# EAGLE board PFC MINI (EAGLE 9.2.2), part 1 of 2
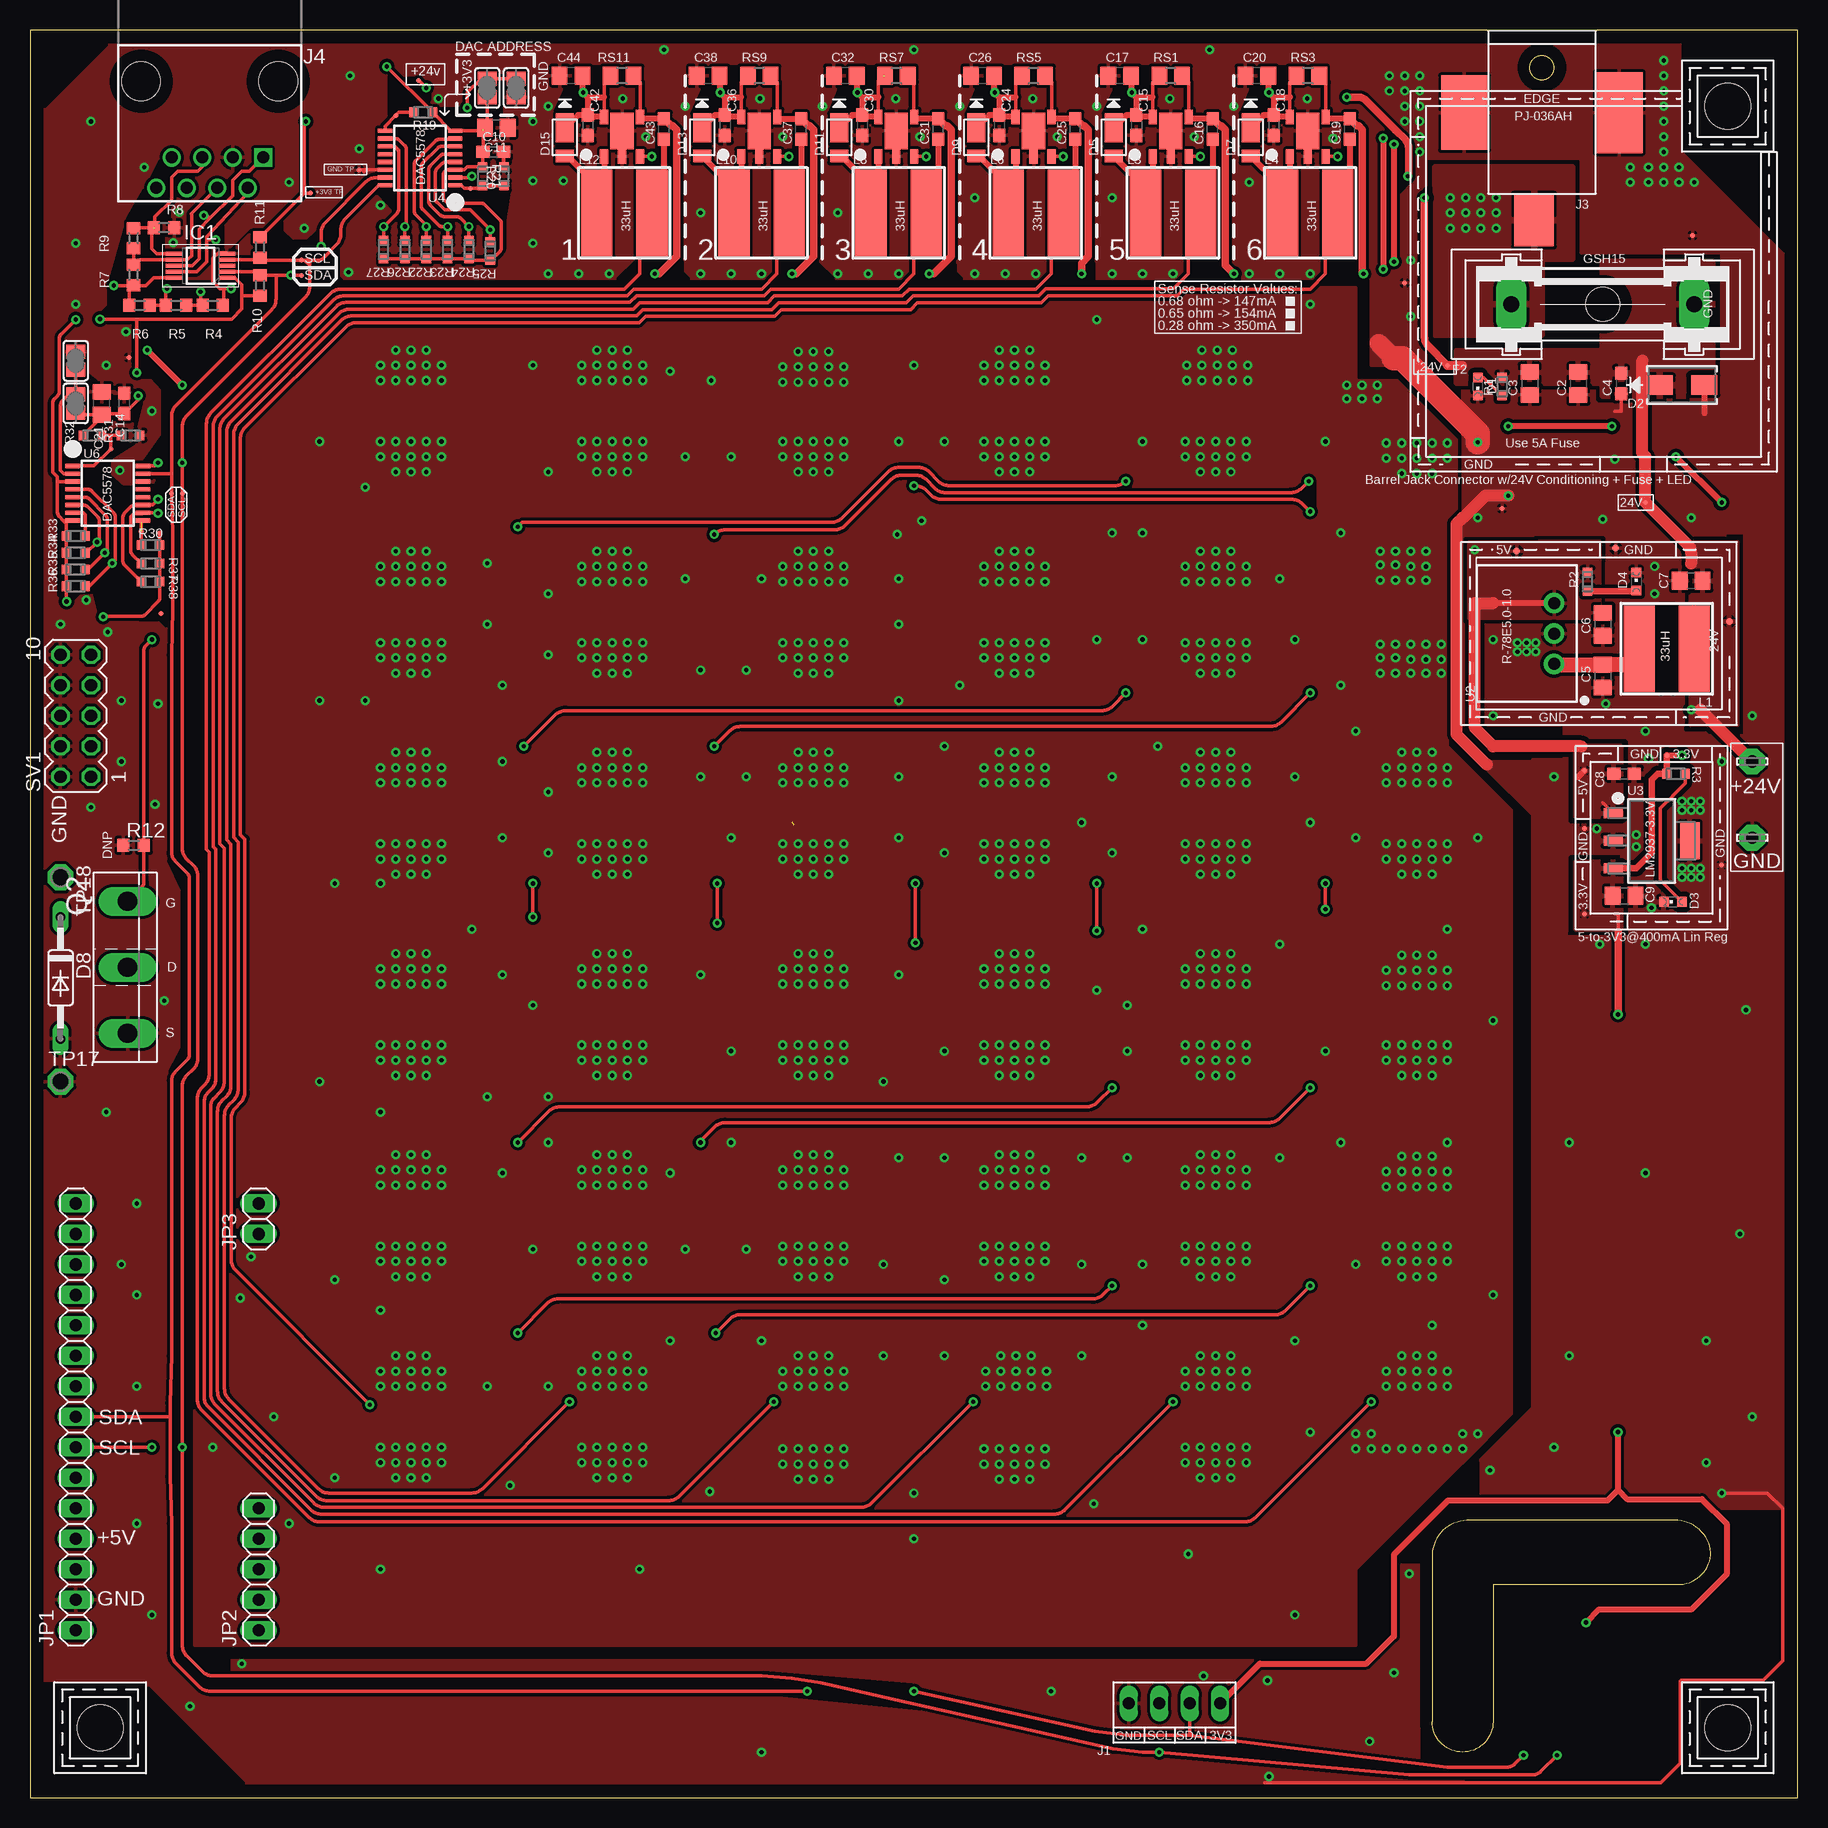
[diagram p3: board, top side]
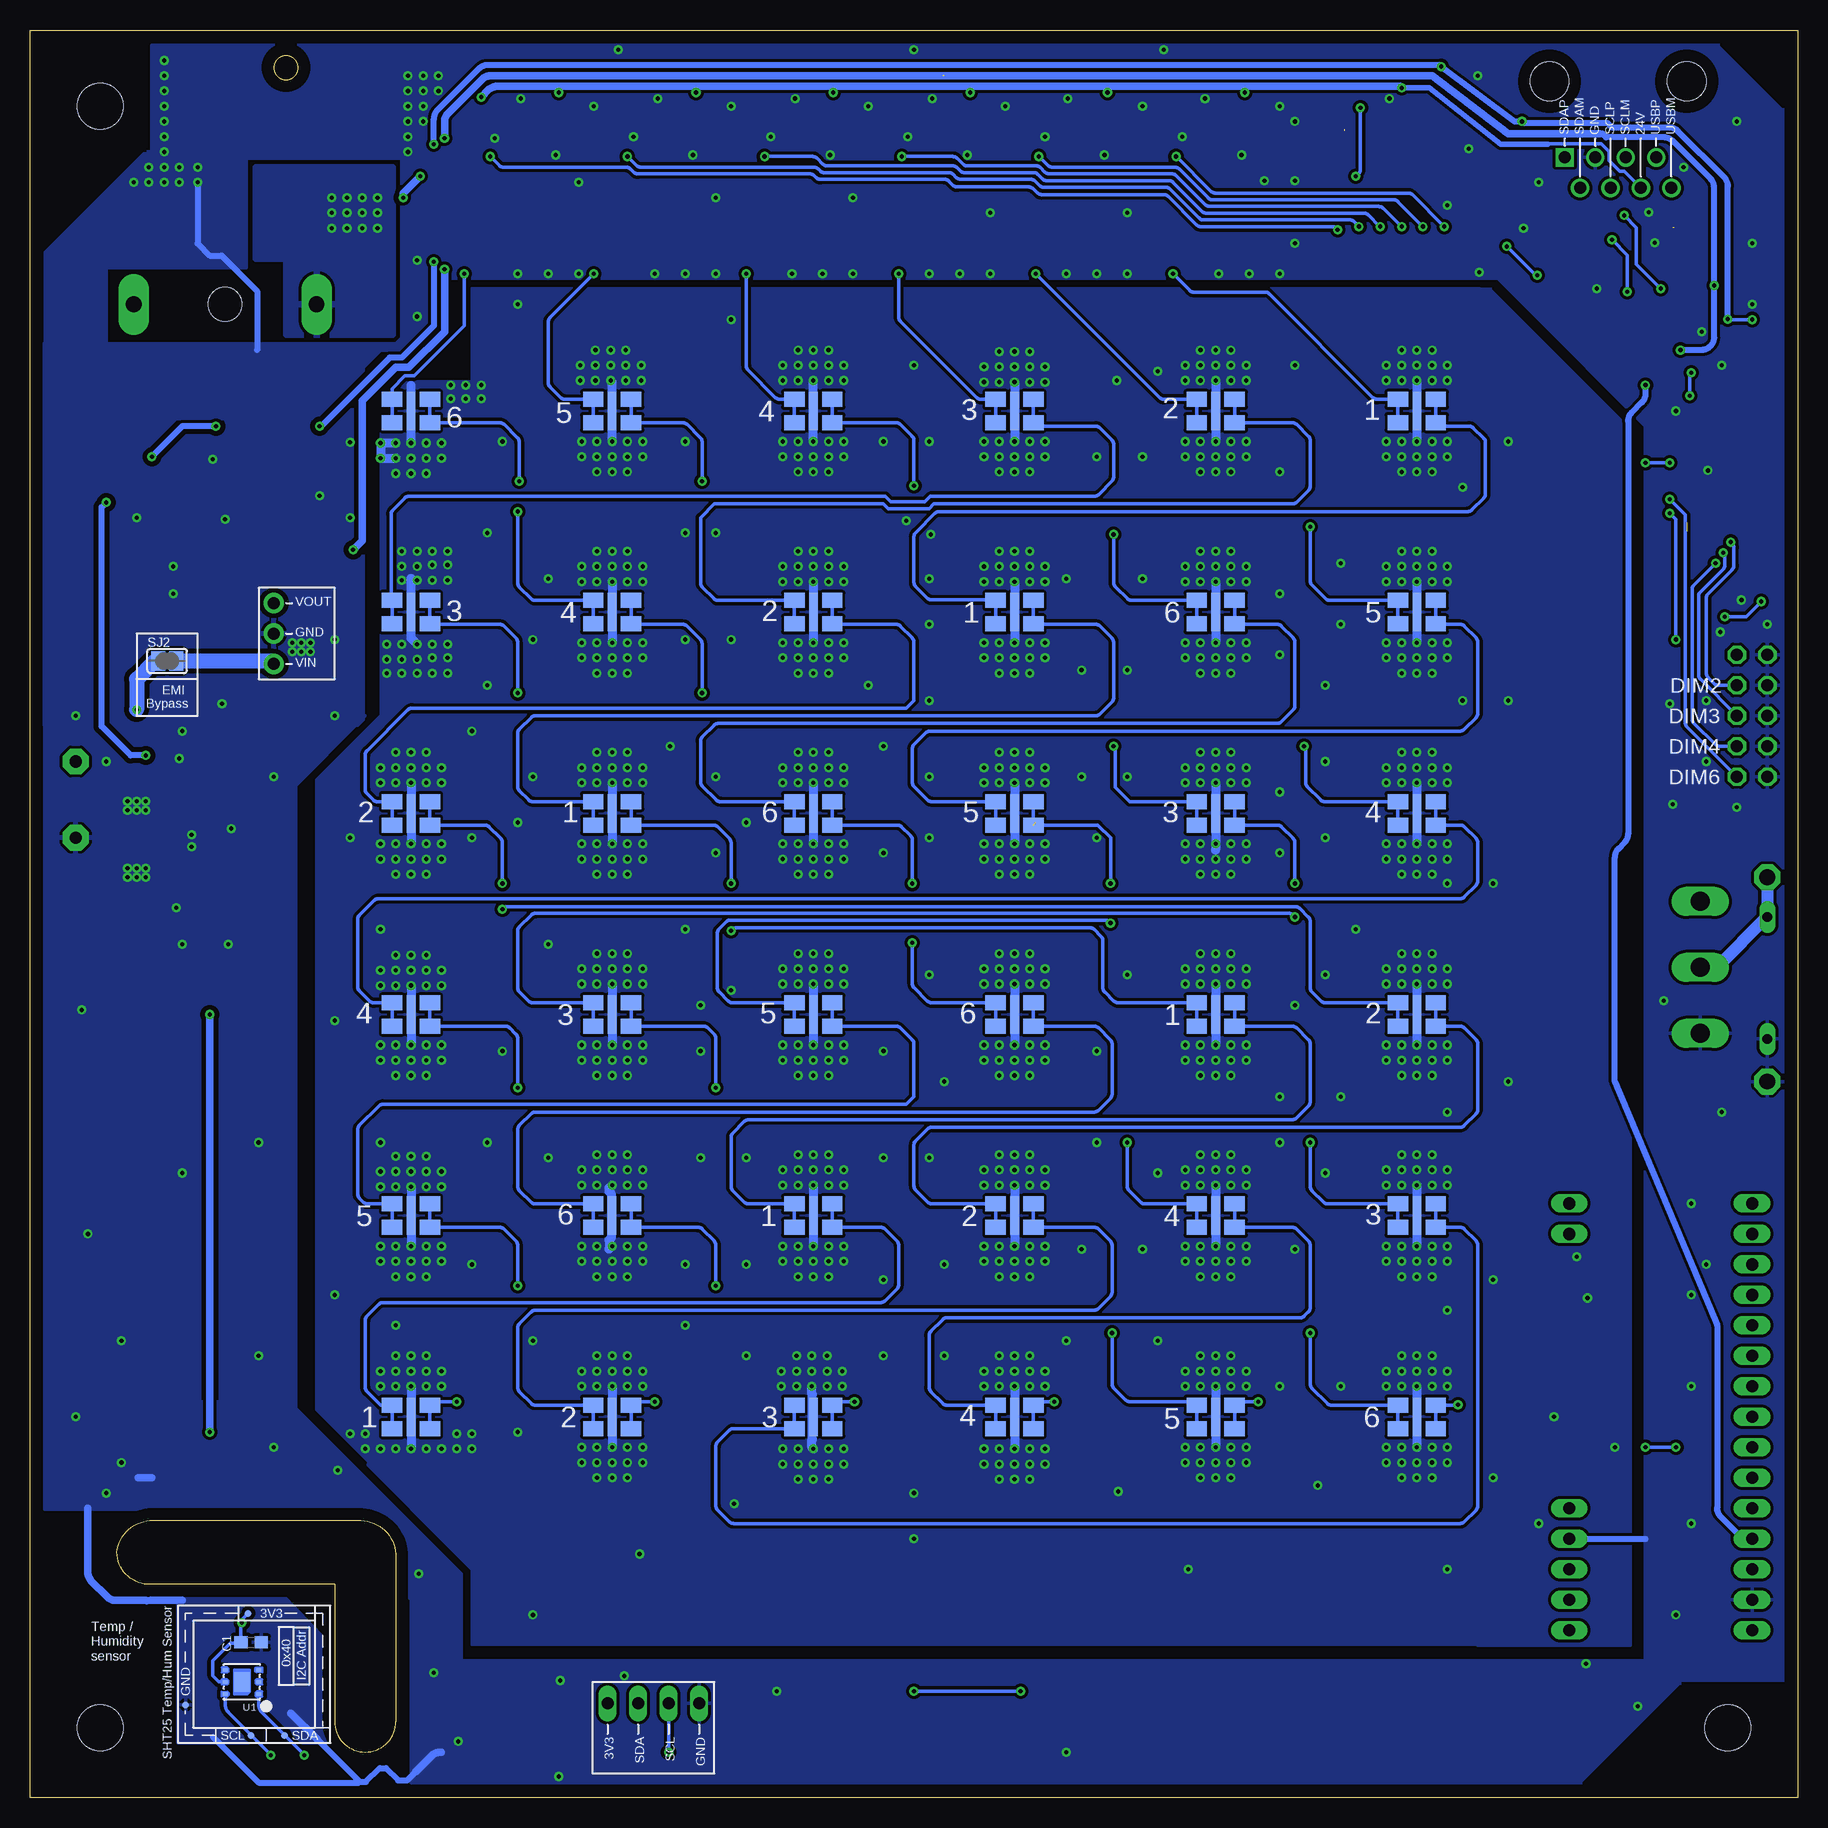
[diagram p4: board, bottom side, seen from below]

Size 147.32 x 147.32 mm. Coordinates in mm from the lower left corner, seen from the top.
Outline: 0,0 147.32,0 147.32,147.32 0,147.32 0,0
Outline: 121.92,17.78 121.92,6.35 arc-90 119.38,3.81 arc-90 116.84,6.35 116.84,20.32 arc-90 120.02,23.11 136.78,23.11 arc-90 140.08,20.45 arc-90 137.29,17.78 121.92,17.78
Copper layers (1*16): Top 0.035mm / dielectric 1.5mm / Bottom 0.035mm
Design rules "default *": minimum track width 6mil, minimum drill 0.35mm, track to track 6mil, track to pad 6mil, pad to pad 6mil, via to via 6mil, smd to smd 6mil, copper to edge 40mil, drill to drill 6mil, minimum pad ring 10mil, minimum via ring 8mil, stop-mask expansion 4mil, vias tented up to drill 14mil, thermal gap 10mil
Net classes: 0 default: width 0.305 mm, drill 0.254 mm, clearance 0.254 mm
tRestrict: 81 lines
bRestrict: 10 lines

## Footprints (pad centres in the part's own frame; a part is rotated, then mirrored left to right if it is on the bottom)
LSP10 = drill 1.016 pad 2.159 octagon: MP 0,0
C0603 = smd 1.1 x 1: 1 -0.85,0; 2 0.85,0
C0805 = smd 1.3 x 1.5: 1 -0.95,0; 2 0.95,0
CHIPLED_0603 = smd 0.8 x 0.8: A 0,-0.75; C 0,0.75
SMA = smd 2.18 x 1.63: 1 -1.857,0; 2 1.857,0
POWERDI123 = smd 1.05 x 1.5: + -1.3,0 | smd 2.4 x 1.5: - 1.05,0
DO35-10 = drill 0.813 long: A 5.08,0; C -5.08,0
GSH15 = drill 1.321 pad 2.54 long: 1 -7.62,0; 2 7.62,0 | hole 2.794: 0,0
SOP50P490X110-10N = smd 1.4 x 0.3: 1 -2.2,1; 2 -2.2,0.5; 3 -2.2,0; 4 -2.2,-0.5; 5 -2.2,-1; 6 2.2,-1; 7 2.2,-0.5; 8 2.2,0; 9 2.2,0.5; 10 2.2,1
HEADER-I2C = drill 1 long: 3V3 3.81,0.762; GND -3.81,0.762; SCL -1.27,0.762; SDA 1.27,0.762
BARREL-JACK-PJ-036AH = smd 4.4 x 3.3: 1 2.2,-0.65 | smd 6.75 x 3.9: 2 -6.75,6.45 | smd 6.2 x 3.9: 3 -6.75,-6.45
OPENAG-V1-RJ45 = drill 1: 24V(6) 1.905,8.89; DSCLM(5) 0.635,6.35; DSCLP(4) -0.635,8.89; DSDAM(2) -3.175,8.89; GND(3) -1.905,6.35; USBM(8) 4.445,8.89; USBP(7) 3.175,6.35 | drill 1 square: DSDAP(1) -4.445,6.35 | hole 3.2: -5.715,0; 5.715,0
1X15 = drill 1.016 long: 1 -17.78,0; 2 -15.24,0; 3 -12.7,0; 4 -10.16,0; 5 -7.62,0; 6 -5.08,0; 7 -2.54,0; 8 0,0; 9 2.54,0; 10 5.08,0; 11 7.62,0; 12 10.16,0; 13 12.7,0; 14 15.24,0; 15 17.78,0
1X05 = drill 1.016 long: 1 -5.08,0; 2 -2.54,0; 3 0,0; 4 2.54,0; 5 5.08,0
1X02 = drill 1.016 long: 1 -1.27,0; 2 1.27,0
29333C = smd 2.6 x 7.2: 1 -2.3,0; 2 2.3,0
TO-247AD-V = drill 1.6 long: D 0,-2.54; G -5.5,-2.54; S 5.5,-2.54
RC0603N = smd 0.756 x 0.8: 1 -0.778,0; 2 0.778,0
R0603 = smd 1 x 1.1: 1 -0.85,0; 2 0.85,0
R0805 = smd 1.3 x 1.5: 1 -0.95,0; 2 0.95,0
EMI-BYPASS = smd 1.168 x 1.6: 1 -0.762,0.254; 2 0.762,0.254
SJ1 = smd 1.168 x 1.6: 1 -0.762,0; 2 0.762,0
MA05-2 = drill 1.016 octagon: 1 -5.08,-1.27; 2 -5.08,1.27; 3 -2.54,-1.27; 4 -2.54,1.27; 5 0,-1.27; 6 0,1.27; 7 2.54,-1.27; 8 2.54,1.27; 9 5.08,-1.27; 10 5.08,1.27
TP06R = smd 0.6 x 0.6: TP 0,0
TP04R = smd 0.4 x 0.4: 1 0,0
P1-13 = drill 1.321 pad 2.159 octagon: TP 0,0
SHT2X = smd 0.3 x 0.4: 1 -1,-1.4; 2 0,-1.4; 3 1,-1.4; 4 1,1.4; 5 0,1.4; 6 -1,1.4 | smd 1.651 x 1.27: 7 0,0
R-78E5.0-1.0 = drill 1 pad 1.676: 1 -2.54,0; 2 0,0; 3 2.54,0
MP04A = smd 1.6 x 0.838: 1 -3.2,2.3; 2 -3.2,0; 3 -3.2,-2.3 | smd 1.6 x 3.099: 4 3.2,0
TSSOP16 = smd 0.35 x 1.2: 1 -2.275,-2.925; 2 -1.625,-2.925; 3 -0.975,-2.925; 4 -0.325,-2.925; 5 0.325,-2.925; 6 0.975,-2.925; 7 1.625,-2.925; 8 2.275,-2.925; 9 2.275,2.925; 10 1.625,2.925; 11 0.975,2.925; 12 0.325,2.925; 13 -0.325,2.925; 14 -0.975,2.925; 15 -1.625,2.925; 16 -2.275,2.925
CORNER = hole 3.81: 0,0
MLELEDCREE = smd 1.7 x 1.25: A1 -1.575,0.975; A2 -1.575,-0.975; C1 1.575,0.975; C2 1.575,-0.975 | smd 0.7 x 3.2: HS 0,0
AL8861 = smd 0.68 x 1.2: 1 -1.5,-1.65; 2 0,-1.65; 3 1.5,-1.65; 4 1.5,1.65; 5 -1.5,1.65 | smd 1.93 x 3.05: 44 0,0.475

## Placement (x,y rotation side)
+24V  LSP10  [LSP10]  143.51,86.36 0 top
C1  0.1uF  [C0603]  128.89,12.96 0 bottom
C2  10uF  [C0805]  129.03,117.86 270 top
C3  4.7uF  [C0805]  124.97,117.86 270 top
C4  0.1uF  [C0603]  132.59,117.86 270 top
C5  10uF  [C0805]  131.06,93.47 270 top
C6  10uF  [C0805]  131.06,97.79 270 top
C7  10uF  [C0805]  138.43,101.41 180 top
C8  0.1uF  [C0603]  132.84,85.34 0 top
C9  10uF  [C0805]  132.84,75.18 0 top
C10  0.1uF  [C0603]  38.61,137.16 0 top
C11  4.7uF  [C0805]  38.86,139.19 0 top
C14  0.1uF  [C0603]  7.87,116.2 90 top
C15  0.1uF  [C0603]  92.2,139.38 270 top
C16  0.1uF  [C0603]  98.55,139.06 90 top
C17  10uF  [C0805]  90.81,143.51 180 top
C18  0.1uF  [C0603]  103.63,139.38 270 top
C19  0.1uF  [C0603]  109.98,139.06 90 top
C20  10uF  [C0805]  102.23,143.51 180 top
C21  4.7uF  [C0805]  5.97,116.2 90 top
C24  0.1uF  [C0603]  80.77,139.38 270 top
C25  0.1uF  [C0603]  87.12,139.06 90 top
C26  10uF  [C0805]  79.38,143.51 180 top
C30  0.1uF  [C0603]  69.34,139.38 270 top
C31  0.1uF  [C0603]  75.69,139.06 90 top
C32  10uF  [C0805]  67.94,143.51 180 top
C36  0.1uF  [C0603]  57.91,139.38 270 top
C37  0.1uF  [C0603]  64.26,139.06 90 top
C38  10uF  [C0805]  56.52,143.51 180 top
C42  0.1uF  [C0603]  46.48,139.38 270 top
C43  0.1uF  [C0603]  52.83,139.06 90 top
C44  10uF  [C0805]  45.09,143.51 180 top
D1  APT1608  [CHIPLED_0603]  120.65,117.6 180 top
D2  SMAJ26A  [SMA]  137.67,117.73 0 top
D3  APT1608  [CHIPLED_0603]  136.91,74.68 90 top
D4  APT1608  [CHIPLED_0603]  133.86,101.35 0 top
D5  SBR2A40P1-7  [POWERDI123]  90.3,138.11 90 top
D7  SBR2A40P1-7  [POWERDI123]  101.73,138.11 90 top
D8  1N4446  [DO35-10]  2.54,68.33 270 top
D9  SBR2A40P1-7  [POWERDI123]  78.87,138.11 90 top
D11  SBR2A40P1-7  [POWERDI123]  67.44,138.11 90 top
D13  SBR2A40P1-7  [POWERDI123]  56.01,138.11 90 top
D15  SBR2A40P1-7  [POWERDI123]  44.58,138.11 90 top
F2  GSH15  [GSH15]  131.06,124.46 0 top
F4  Use 5A Fuse  [FUSE-CARTRIDGE]  122.94,112.52 0 top
GND  LSP10  [LSP10]  143.51,80.01 0 top
IC1  PCA9615DP  [SOP50P490X110-10N]  14.21,127.68 180 top
J1  I2C-HEADER  [HEADER-I2C]  95.38,7.11 0 top
J3  PJ-036AH  [BARREL-JACK-PJ-036AH]  125.98,133.68 270 top
J4  54602-908LF  [OPENAG-V1-RJ45]  14.98,143.05 180 top
JP1  [1X15]  3.81,31.75 90 top
JP2  [1X05]  19.05,19.05 90 top
JP3  [1X02]  19.05,48.26 90 top
L1  33uH  [29333C]  136.4,95.76 180 top
L3  33uH  [29333C]  95.25,132.08 0 top
L4  33uH  [29333C]  106.68,132.08 0 top
L6  33uH  [29333C]  83.82,132.08 0 top
L8  33uH  [29333C]  72.39,132.08 0 top
L10  33uH  [29333C]  60.96,132.08 0 top
L12  33uH  [29333C]  49.53,132.08 0 top
Q2  IRFP250  [TO-247AD-V]  10.67,69.22 270 top
R1  1K  [RC0603N]  122.68,117.6 90 top
R2  100  [RC0603N]  129.79,101.35 90 top
R3  100  [RC0603N]  137.16,85.34 180 top
R4  600  [R0603]  15.23,124.38 0 top
R5  120  [R0603]  12.18,124.38 0 top
R6  600  [R0603]  9.13,124.38 0 top
R7  600  [R0603]  8.63,126.92 270 top
R8  600  [R0603]  11.17,130.85 180 top
R9  120  [R0603]  8.63,129.96 270 top
R10  10K  [R0603]  19.17,126.03 270 top
R11  10K  [R0603]  19.17,129.2 90 top
R12  [R0603]  8.64,79.38 0 top
R19  1K  [RC0603N]  32.77,140.46 180 top
R20  0 OHM  [RC0603N]  39.5,135.13 270 top
R21  1K  [RC0603N]  37.72,135.13 270 top
R22  1K  [RC0603N]  33.02,129.03 270 top
R23  1K  [RC0603N]  34.8,129.03 270 top
R24  1K  [RC0603N]  36.58,129.03 270 top
R25  1K  [RC0603N]  38.35,128.91 270 top
R26  1K  [RC0603N]  31.24,129.03 270 top
R27  1K  [RC0603N]  29.46,129.03 270 top
R30  1K  [RC0603N]  10.03,104.39 180 top
R31  0 OHM  [RC0603N]  8.38,113.54 180 top
R32  1K  [RC0603N]  5.21,113.54 0 top
R33  1K  [RC0603N]  3.81,105.16 180 top
R34  1K  [RC0603N]  3.81,103.76 180 top
R35  1K  [RC0603N]  3.81,102.36 180 top
R36  1K  [RC0603N]  3.81,100.97 180 top
R37  1K  [RC0603N]  10.03,102.87 0 top
R38  1K  [RC0603N]  10.03,101.35 0 top
RS1  6.34 ohm  [R0805]  95.06,143.51 180 top
RS3  0.66 ohm  [R0805]  106.49,143.51 180 top
RS5  6.34 ohm  [R0805]  83.63,143.51 180 top
RS7  6.34 ohm  [R0805]  72.2,143.51 180 top
RS9  6.34 ohm  [R0805]  60.77,143.51 180 top
RS11  6.34 ohm  [R0805]  49.34,143.51 180 top
SJ2  [EMI-BYPASS]  135.89,94.49 0 bottom
SJ_A1  [SJ1]  38.1,142.49 90 top
SJ_A2  [SJ1]  40.51,142.49 90 top
SJ_A5  [SJ1]  3.81,116.2 90 top
SJ_A6  [SJ1]  3.81,119.76 270 top
SV1  [MA05-2]  3.81,90.17 90 top
TP1  TPTP06R  [TP06R]  126.1,5.21 270 bottom
TP2  TPTP06R  [TP06R]  128.89,5.21 270 bottom
TP3  TPTP06R  [TP06R]  134.36,7.75 270 bottom
TP4  TPTP06R  [TP06R]  129.15,15.37 270 bottom
TP5  TPTP06R  [TP06R]  123.89,103.89 90 top
TP6  TPTP06R  [TP06R]  141.6,98.04 90 top
TP7  TPTP04R  [TP04R]  134.62,107.95 0 top
TP8  TPTP04R  [TP04R]  122.68,107.44 0 top
TP9  TPTP04R  [TP04R]  138.56,130.18 0 top
TP10  TPTP04R  [TP04R]  118.11,119.38 0 top
TP11  TPTP06R  [TP06R]  132.14,104.14 90 top
TP12  TPTP04R  [TP04R]  136.4,86.87 270 top
TP13  TPTP04R  [TP04R]  129.54,85.6 270 top
TP14  TPTP04R  [TP04R]  140.97,77.72 270 top
TP15  TPTP04R  [TP04R]  129.54,73.66 270 top
TP16  TPTP04R  [TP04R]  129.54,80.77 270 top
TP17  TPPAD1-13  [P1-13]  2.54,59.69 0 top
TP18  TPPAD1-13  [P1-13]  2.54,76.71 270 top
TP23  TPTP04R  [TP04R]  32.38,143.13 270 top
TP24  TPTP04R  [TP04R]  23.37,133.73 270 top
TP25  TPTP04R  [TP04R]  27.43,135.64 90 top
TP26  TPTP04R  [TP04R]  22.61,126.87 270 top
TP27  TPTP04R  [TP04R]  22.61,128.14 270 top
TP28  TPTP04R  [TP04R]  36.7,134.11 270 top
TP29  TPTP04R  [TP04R]  30.48,140.21 270 top
TP30  TPTP04R  [TP04R]  8.26,120.02 180 top
TP31  TPTP04R  [TP04R]  114.55,126.24 0 top
TP36  TPTP04R  [TP04R]  10.79,105.41 270 top
TP37  TPTP04R  [TP04R]  10.92,98.68 90 top
TP38  TPTP04R  [TP04R]  11.81,108.71 270 top
TP39  TPTP04R  [TP04R]  12.7,108.71 270 top
TP40  TPTP04R  [TP04R]  6.73,112.39 270 top
TP41  TPTP04R  [TP04R]  9.27,105.54 270 top
U1  SHT25  [SHT2X]  129.66,9.66 90 bottom
U2  R-78E5.0-1.0  [R-78E5.0-1.0]  127,97.03 90 top
U3  LM2937-3.3V  [MP04A]  135.13,79.76 0 top
U4  DAC5578  [TSSOP16]  32.51,136.65 90 top
U6  DAC5578  [TSSOP16]  6.48,108.71 270 top
U$1  [CORNER]  141.48,140.97 180 top
U$2  MLELED  [MLELEDCREE]  31.75,115.57 0 bottom
U$3  MLELED  [MLELEDCREE]  65.28,98.81 0 bottom
U$4  MLELED  [MLELEDCREE]  98.81,82.04 0 bottom
U$5  MLELED  [MLELEDCREE]  48.51,65.28 0 bottom
U$6  MLELED  [MLELEDCREE]  82.04,48.51 0 bottom
U$7  MLELED  [MLELEDCREE]  115.57,31.75 0 bottom
U$8  MLELED  [MLELEDCREE]  48.51,115.57 0 bottom
U$9  MLELED  [MLELEDCREE]  82.04,98.81 0 bottom
U$10  MLELED  [MLELEDCREE]  115.57,82.04 0 bottom
U$11  MLELED  [MLELEDCREE]  31.75,65.28 0 bottom
U$12  MLELED  [MLELEDCREE]  65.28,48.51 0 bottom
U$13  MLELED  [MLELEDCREE]  98.81,31.75 0 bottom
U$14  MLELED  [MLELEDCREE]  65.28,115.57 0 bottom
U$15  MLELED  [MLELEDCREE]  115.57,98.81 0 bottom
U$16  MLELED  [MLELEDCREE]  48.51,82.04 0 bottom
U$17  MLELED  [MLELEDCREE]  98.81,65.28 0 bottom
U$18  MLELED  [MLELEDCREE]  31.75,48.51 0 bottom
U$19  MLELED  [MLELEDCREE]  82.04,31.75 0 bottom
U$20  MLELED  [MLELEDCREE]  82.04,115.57 0 bottom
U$21  MLELED  [MLELEDCREE]  98.81,98.81 0 bottom
U$22  MLELED  [MLELEDCREE]  31.75,82.04 0 bottom
U$23  MLELED  [MLELEDCREE]  115.57,65.28 0 bottom
U$24  MLELED  [MLELEDCREE]  48.51,48.51 0 bottom
U$25  MLELED  [MLELEDCREE]  65.28,31.75 0 bottom
U$26  MLELED  [MLELEDCREE]  98.81,115.57 0 bottom
U$27  MLELED  [MLELEDCREE]  31.75,98.81 0 bottom
U$28  MLELED  [MLELEDCREE]  65.28,82.04 0 bottom
U$29  MLELED  [MLELEDCREE]  82.04,65.28 0 bottom
U$30  MLELED  [MLELEDCREE]  115.57,48.51 0 bottom
U$31  MLELED  [MLELEDCREE]  48.51,31.75 0 bottom
U$32  MLELED  [MLELEDCREE]  115.57,115.57 0 bottom
U$33  MLELED  [MLELEDCREE]  48.51,98.81 0 bottom
U$34  MLELED  [MLELEDCREE]  82.04,82.04 0 bottom
U$35  MLELED  [MLELEDCREE]  65.28,65.28 0 bottom
U$36  MLELED  [MLELEDCREE]  98.81,48.51 0 bottom
U$37  MLELED  [MLELEDCREE]  31.75,31.75 0 bottom
U$38  AL8861  [AL8861]  95.06,138.43 0 top
U$39  [CORNER]  141.48,5.84 90 top
U$40  AL8861  [AL8861]  106.49,138.43 0 top
U$41  [CORNER]  5.84,5.84 0 top
U$42  AL8861  [AL8861]  83.63,138.43 0 top
U$44  AL8861  [AL8861]  72.2,138.43 0 top
U$46  AL8861  [AL8861]  60.77,138.43 0 top
U$48  AL8861  [AL8861]  49.34,138.43 0 top

## Tracks (layer width: path | path; a pad name or v marks a point on that pad's centre or on a via)
24V_EMI
  Top 1.27: U2.1 127.07,94.42 C5.1 132.76,94.42 arc90 L1.2
  Bottom 1.27: SJ2.2 127.25,94.74 U2.1
24V_IN1  (via drill 0.35)
  other vias: 122.17,132.08 122.17,130.81 120.9,132.08 120.9,130.81 119.63,132.08 119.63,130.81 118.36,132.08 118.36,133.35 122.17,133.35 118.36,130.81 119.63,133.35 120.9,133.35
  pour Bottom (isolate 0.406): 125.98,121.92 117.09,121.92 117.09,135.89 128.52,135.89 128.52,128.27 125.98,128.27
  pour Top (isolate 0.406): 117.09,121.92 125.98,121.92 125.98,128.27 128.52,128.27 128.52,135.89 117.09,135.89
!LDAC1!
  Top 0.305: R32.2 6.73,113.54 | 6.73,113.54 R31.2 | U6.1 5.32,110.99 TP40.1 6.73,113.54
!LDAC!
  Top 0.305: U4.1 35.93,134.38 36.2,134.11 TP28.1 37.21,134.11 37.45,134.35 R21.2 R20.2
+3V3  (via drill 0.35)  (1 unrouted)
  Top 0.305: 17.64,125.09 17.64,124.08 16.8,123.23 8.89,123.23 | 17.64,125.09 17.64,126.11 17.08,126.68 IC1.1 | R10.2 17.73,125.18 17.64,125.09 | R11.2 22.85,133.73 | 22.85,133.73 22.86,133.75 22.86,139.57 v22.99,139.7 | v5.83,123.23 8.89,123.23 | 37.76,139.04 C11.1 38.1,139.38 SJ_A1.1 | v29.72,144.27 29.73,144.27 R19.1 35.08,138.93 U4.8 37.76,138.93 C10.1 37.72,137.12 R21.1 37.69,135.93 36.45,135.93 36.2,135.68 U4.3 34.71,135.68 34.57,135.53 arc45 34.42,135.17 34.42,133.27 34.65,133.04 arc45 35.01,132.89 37.55,132.89 arc-45 37.91,132.74 39.14,131.52 arc-45 39.29,131.16 39.29,129.22 arc-45 39.14,128.86 38.41,128.13 R25.2 36.7,128.13 R24.2 R23.2 R22.2 R26.2 R27.2 | TP24.1 22.85,133.73 | 132.33,72.14 132.33,73.66 132.08,73.66 | U6.8 2.78,106.44 | 2.29,109.69 2.29,110.08 1.91,110.46 1.91,116.25 arc-45 2.05,116.61 2.3,116.86 arc45 2.45,117.21 2.45,121.62 arc-45 2.6,121.98 v3.81,123.19 | 2.78,106.44 3.03,106.19 R33.2 R34.2 R35.2 R36.2 3.03,99.71 v3.05,99.69 | v9.02,116.84 9.02,116.5 C14.1 6.25,115.36 | v8.89,118.75 8.89,123.23 | TP36.1 R30.1 R37.2 R38.2 10.81,100.03 arc-45 10.66,99.67 9.59,98.6 arc-45 9.23,98.45 6.1,98.45 v6.1,98.42 | 6.25,115.36 6.07,115.36 C21.1 4,115.25 SJ_A5.1 | R32.1 6.25,115.36 | U6.3 2.29,109.69 | 2.29,109.69 2.29,107.14 arc45 2.44,106.78 2.78,106.44
  Top 0.508: v129.67,14.61 130.74,15.68 138.43,15.68 141.43,18.68 141.43,22.78 139.32,24.89 133.1,24.89 132.33,25.65 | TP12.1 v137.67,86.87 | v131.83,114.3 v123.19,114.3 | v137.16,111.76 v140.97,107.95 | J1.3V3 102.49,11.18 111.37,11.18 113.65,13.46 113.65,20.27 118.19,24.8 131.48,24.8 132.33,25.65 | 132.33,25.65 v132.33,30.48 | v113.67,137.79 v113.67,128.02
  Top 0.559: TP12.1 136.4,85.36 R3.2 135.64,85.34 135.13,84.84 135.13,78.74 133.84,77.46 U3.3
  Top 0.61: v132.33,65.28 132.33,72.14
  Bottom 0.305: TP4.TP 129.67,14.86 v129.67,14.61 129.75,14.53 C1.1 129.66,12.87 130.64,12.87 132.08,11.43 132.08,10.16 131.58,9.66 U1.5 | v6.1,98.42 4.32,98.42 v3.05,99.69 | v8.89,118.75 9.02,118.62 v9.02,116.84 | v3.81,123.19 5.79,123.19 v5.83,123.23
  Bottom 0.508: v137.67,86.87 138.94,86.87 141.35,89.28 141.35,107.57 v140.97,107.95 | v137.16,111.76 134.62,114.3 v131.83,114.3 | v123.19,114.3 123.06,114.3 117.35,120.02 116.33,120.02 113.67,122.68 v113.67,128.02 | v113.67,137.79 113.67,139.92 arc45 113.37,140.64 109.91,144.1 arc45 109.19,144.4 29.84,144.4 v29.72,144.27 23.62,139.7 v22.99,139.7 22.86,139.57 15.88,139.57 15.49,139.19 10.71,139.19 arc45 9.99,138.89 6.13,135.03 arc45 5.83,134.32 v5.83,123.23
  Bottom 0.61: v132.33,65.28 v132.33,30.48
  pour Top (isolate 0.305): 128.78,72.39 132.59,72.39 132.59,77.98 128.78,77.98
+5V  (via drill 0.35)
  Top 0.305: U3.1 131.06,82.92 | IC1.10 10.29,126.68 9.64,126.03 8.66,126.03 | 8.66,126.03 R7.2 | R6.1 8.28,125.65 8.66,126.03 | v6.97,126.03 8.66,126.03
  Top 0.508: U2.3 121.92,99.57 121.41,99.57 | v112.78,138.3 v112.78,127.38 | v12.7,117.73 v9.78,120.65
  Top 0.559: TP13.1 129.03,85.09
  Top 1.016: 121.92,99.57 120.4,99.57 120.4,89.15 121.92,87.63 129.29,87.63
  Bottom 0.508: 16.51,138.68 16.3,138.68 15.98,138.37 11.09,138.37 arc45 10.48,138.11 7.27,134.91 arc45 6.97,134.19 v6.97,126.03 6.97,121.72 arc45 7.27,121 7.32,120.95 arc45 8.04,120.65 v9.78,120.65 | v12.7,117.73 12.7,117.01 arc45 13,116.29 13.85,115.44 arc-45 14.15,114.72 14.15,80.32 arc45 14.45,79.6 14.94,79.1 arc-45 15.24,78.39 15.24,59.69 6.73,39.37 6.73,24.15 arc-45 6.43,23.43 4.89,21.89 arc-45 4.17,21.59 JP1.4
  Bottom 0.61: 16.51,138.68 24.13,138.68 30.48,143.51 108.93,143.51 arc-45 109.64,143.21 112.48,140.38 arc-45 112.78,139.66 v112.78,138.3 | v120.4,104.01 119.63,104.78 119.63,116.41 116.84,119.2 115.76,119.2 112.78,122.19 v112.78,127.38
  pour Top (isolate 0.305): 119.89,104.65 130.81,104.65 130.81,98.3 119.89,98.3
  pour Top (isolate 0.406): 130.81,103.38 130.81,104.65 125.73,104.65 125.73,103.38
  pour Top (isolate 0.305): 128.78,87.63 128.78,81.79 132.59,81.79 132.59,87.63
  pour Top (isolate 0.406): 128.78,82.55 130.05,82.55 130.05,87.63 128.78,87.63
+24V  (via drill 0.35)  (1 unrouted)
  Top 0.305: TP7.1 135.13,107.44 135.13,107.19 | TP23.1 v33.02,142.49 | RS11.2 47.84,142.96 47.84,141.73 U$48.5 | 46.99,140.08 46.63,140.08 C42.1 | 46.48,143.06 C44.1 | C38.1 57.91,143.06 | U$46.5 59.27,141.73 59.27,142.96 RS9.2 | C32.1 69.34,143.06 | 69.34,140.46 C30.1 69.5,140.08 | U$44.5 70.7,141.73 70.7,143.09 71.12,143.51 | C26.1 80.77,143.06 | U$42.5 82.13,141.73 82.13,142.96 RS5.2 | C17.1 92.2,143.06 | 92.2,140.46 C15.1 92.36,140.08 | U$38.5 93.56,141.73 93.56,142.96 RS1.2 | C20.1 103.63,143.06 | U$40.5 104.99,141.73 104.99,142.96 RS3.2 | 103.78,140.08 C18.1 | 80.92,140.08 C24.1 | 79.07,139.37 D9.- | 67.64,139.37 D11.- | 58.06,140.08 C36.1
  Top 0.508: U$40.5 103.78,140.08 | U$38.5 92.36,140.08 | U$42.5 80.92,140.08 | U$44.5 69.5,140.08 | U$46.5 58.06,140.08 | U$48.5 46.99,140.08 | C15.1 91.37,140.23 D5.- | 79.07,139.37 79.94,140.23 C24.1 80.77,141.73 | D7.- 102.8,140.23 C18.1 103.63,141.73 | C30.1 68.51,140.23 67.64,139.37 | D13.- 57.08,140.23 C36.1 57.91,141.73 | D15.- 45.65,140.23 C42.1 46.48,141.73 | C20.1 103.19,142.18 v103.25,142.11 103.63,141.73 | C17.1 91.75,142.18 v91.82,142.11 92.2,141.73 | C26.1 80.33,142.18 v80.39,142.11 80.77,141.73 | C32.1 68.89,142.18 v68.96,142.11 69.34,141.73 | C38.1 57.47,142.18 v57.53,142.11 57.91,141.73 | C44.1 46.03,142.18 v46.1,142.11 46.48,141.73 | 69.34,141.73 69.34,140.46 | 92.2,141.73 92.2,140.46 | 46.48,141.73 47.84,141.73 | 57.91,141.73 59.27,141.73 | 69.34,141.73 70.7,141.73 | 80.77,141.73 82.13,141.73 | 92.2,141.73 93.56,141.73 | 103.63,141.73 104.99,141.73
  Top 0.61: 113.76,138.97 113.82,138.97 | v114.81,135.13 114.89,135.21 114.89,137.48 arc45 114.59,138.2 113.82,138.97 | 139.19,90.68 v138.43,90.68 | v109.73,141.73 110.63,141.73 arc-45 111.35,141.43 113.82,138.97 | TP10.1 116.5,120.99 arc-45 116.2,121.71 v116.2,133.35
  Top 0.762: TP10.1 119.38,119.38
  Top 1.016: 138.43,102.87 138.43,103.72 arc45 138.13,104.44 TP7.1 134.62,111.76 134.37,112.01 134.37,119.76 | +24V.MP 139.19,90.68
  Bottom 0.305: J4.24V(6) 14.45,135.53 14.82,135.53 15.72,136.43 15.72,137.18 16.4,137.86 20.77,137.86 20.83,137.79
  Bottom 0.457: 20.83,137.79 24.77,137.79 30.73,142.49 v33.02,142.49
  Bottom 0.61: 46.1,142.62 33.15,142.62 v33.02,142.49 | 46.1,142.62 57.53,142.62 | 57.53,142.62 68.96,142.62 | 68.96,142.62 80.39,142.62 | 80.39,142.62 91.82,142.62 | 91.82,142.62 103.25,142.62 | v103.25,142.11 103.25,142.62 | v91.82,142.11 91.82,142.62 | v80.39,142.11 80.39,142.62 | v68.96,142.11 68.96,142.62 | v57.53,142.11 57.53,142.62 | v46.1,142.11 46.1,142.62 | v114.81,135.13 116.2,133.73 v116.2,133.35 | v109.73,141.73 109.14,142.32 arc45 108.42,142.62 103.25,142.62
  Bottom 1.27: SJ2.1 136.91,94.74 138.43,93.22 v138.43,90.68
  pour Top (isolate 0.406): 140.21,116.84 140.21,128.02 131.06,128.02 131.06,116.84
  pour Top (isolate 0.406): 131.57,120.65 131.57,117.86 118.87,117.86 118.87,120.65
  pour Top (isolate 0.406): 138.43,104.65 142.24,104.65 142.24,89.41 138.43,89.41
ADDR0  (via drill 0.35)
  Top 0.305: SJ_A2.2 SJ_A1.2 37.59,143.26 36.45,142.11 v36.45,140.84 | U4.2 36.73,135.03 v36.83,135.13
  Bottom 0.305: v36.83,135.13 36.6,135.36 arc-45 36.45,135.72 v36.45,140.84
ADDR1
  Top 0.305: SJ_A6.2 SJ_A5.2 3.81,116.71 2.99,116.71 2.69,116.41 arc45 2.54,116.05 2.54,110.62 2.82,110.34 U6.2
DAC_!CLR1!  (1 unrouted)
  Top 0.305: U6.9 9.27,106.3 | 9.27,106.3 9.26,106.29 R30.2 | 9.27,106.3
DAC_!CLR!
  Top 0.305: R19.2 30.73,140.46 TP29.1 29.59,139.31 U4.9
DIM1  (via drill 0.35)
  Top 0.305: R22.1 v33.02,130.94 33.02,131.04 32.18,131.88 arc-45 32.03,132.24 32.03,136.11 arc-45 32.18,136.47 33.76,138.06 arc-45 34.12,138.21 35.37,138.21 U4.7 | U$44.3 v74.67,136.78 v74.68,136.78
  Bottom 0.305: v33.02,130.94 34.55,132.47 arc-45 34.91,132.61 49.02,132.61 arc45 49.38,132.76 51.8,135.18 arc-45 52.16,135.33 62.38,135.33 arc45 62.74,135.48 63.1,135.85 arc-45 63.46,135.99 69.2,135.99 arc45 69.56,136.14 70.05,136.63 arc-45 70.41,136.78 v74.68,136.78
DIM1B
  Top 0.305: U6.7 4.42,107.09 4.59,106.92 R33.1
DIM2  (via drill 0.35)
  Top 0.305: R23.1 v34.8,130.94 34.37,130.94 arc-45 34.01,131.09 32.74,132.36 arc-45 32.59,132.72 32.59,135.88 arc-45 32.74,136.24 33.97,137.48 arc-45 34.33,137.63 U4.6 | U$42.3 v86.11,136.78
  Bottom 0.305: v34.8,130.94 34.82,130.94 35.79,131.91 arc-45 36.15,132.06 49.29,132.06 arc45 49.65,132.2 52.07,134.62 arc-45 52.43,134.77 62.61,134.77 arc45 62.97,134.92 63.33,135.29 arc-45 63.69,135.44 69.44,135.44 arc45 69.8,135.58 70.06,135.85 arc-45 70.42,135.99 80.89,135.99 arc45 81.25,136.14 81.73,136.63 arc-45 82.09,136.78 v86.11,136.78
DIM2B  (via drill 0.35)
  Top 0.305: R34.1 4.7,103.76 v5.59,104.65 5.78,104.84 5.78,106.41 arc45 5.63,106.77 4.81,107.59 arc45 4.45,107.74 U6.6
  Bottom 0.305: v5.59,104.65 5.48,104.54 arc45 5.33,104.18 5.33,102.7 arc45 5.48,102.34 7.47,100.35 arc-45 7.62,99.99 7.62,93.71 arc-45 7.47,93.35 6.98,92.86 arc-45 6.62,92.71 SV1.7
DIM3  (via drill 0.35)
  Top 0.305: R24.1 v36.58,130.94 35.89,131.63 arc45 35.53,131.78 34.52,131.78 arc-45 34.16,131.92 33.37,132.72 arc-45 33.22,133.07 33.22,135.66 arc-45 33.37,136.02 34.18,136.83 arc-45 34.54,136.98 U4.5 | U$38.3 v97.53,136.78 v97.54,136.78
  Bottom 0.305: v36.58,130.94 36.99,131.35 arc-45 37.34,131.5 49.53,131.5 arc45 49.88,131.65 52.3,134.06 arc-45 52.66,134.21 62.84,134.21 arc45 63.2,134.36 63.56,134.72 arc-45 63.92,134.87 69.77,134.87 arc45 70.13,135.02 70.39,135.29 arc-45 70.75,135.44 81.12,135.44 arc45 81.48,135.58 81.63,135.74 arc-45 81.99,135.89 96.44,135.89 arc45 96.8,136.04 v97.54,136.78
DIM3B  (via drill 0.35)
  Top 0.305: R35.1 4.84,102.36 6.22,103.74 v6.22,103.76 6.44,103.97 6.44,106.54 arc45 6.29,106.89 4.95,108.24 | 4.95,108.24 arc45 4.59,108.39 | 4.95,108.24 arc45 4.59,108.39 | 4.59,108.39 U6.5
  Bottom 0.305: v6.22,103.76 v6.22,103.76 arc45 6.07,103.4 6.07,102.75 arc45 6.22,102.4 8.11,100.51 arc-45 8.26,100.15 8.26,93.56 arc-45 8.11,93.2 SV1.5
DIM4  (via drill 0.35)
  Top 0.305: R25.1 v38.35,130.68 36.7,132.33 34.54,132.33 33.93,132.95 arc-45 33.78,133.31 33.78,135.43 arc-45 33.93,135.78 34.32,136.18 arc-45 34.68,136.33 U4.4 | U$40.3 v108.97,136.78
  Bottom 0.305: v38.35,130.68 38.46,130.79 arc-45 38.82,130.94 49.76,130.94 arc45 50.12,131.09 52.49,133.46 arc-45 52.84,133.6 63.02,133.6 arc45 63.38,133.75 63.72,134.09 arc-45 64.08,134.24 70.05,134.24 arc45 70.41,134.39 70.75,134.72 arc-45 71.11,134.87 81.45,134.87 arc45 81.81,135.02 81.97,135.18 arc-45 82.33,135.33 96.67,135.33 arc45 97.03,135.48 97.29,135.74 arc-45 97.65,135.89 107.87,135.89 arc45 108.23,136.04 v108.97,136.78
DIM4B  (via drill 0.35)
  Top 0.305: R36.1 4.95,100.97 v6.86,102.87 7.11,103.12 7.11,106.72 arc45 6.96,107.08 5.16,108.89 arc45 4.8,109.04 U6.4
  Bottom 0.305: v6.86,102.87 8.67,101.06 arc-45 8.82,100.7 8.82,89.93 arc-45 8.67,89.57 6.88,87.78 arc-45 6.52,87.63 SV1.3
DIM5  (via drill 0.35)
  Top 0.305: R26.1 v31.24,130.94 31.37,131.06 31.37,137.33 arc45 31.22,137.69 30.74,138.17 arc45 30.48,138.28 U4.10 | U$46.3 v63.24,136.78 v63.25,136.78
  Bottom 0.305: v31.24,130.94 33.33,133.02 arc-45 33.69,133.17 48.79,133.17 arc45 49.15,133.32 51.57,135.74 arc-45 51.93,135.89 62.15,135.89 arc45 62.51,136.04 v63.25,136.78
DIM5B  (via drill 0.35)
  Top 0.305: v10.67,107.06 10.64,107.09 U6.10 9.33,107.02 8.63,107.02 8.38,106.77 8.38,103.95 arc45 8.53,103.59 R37.1 | v10.16,96.52 9.63,96 arc45 9.49,95.64 R12.2 9.49,76.28 arc-45 9.34,75.92 Q2.G
  Bottom 0.305: v10.67,107.06 10.16,106.55 v10.16,96.52
DIM6  (via drill 0.35)
  Top 0.305: R27.1 v29.46,130.94 30.59,132.06 arc45 30.73,132.42 30.73,137.08 | U4.11 30.39,137.63 30.59,137.44 | 30.59,137.44 30.73,137.29 30.73,137.08 | 30.59,137.44 arc-45 30.73,137.08 | v51.82,136.78 U$48.3
  Bottom 0.305: v51.82,136.78 48.92,133.88 arc-45 48.56,133.73 32.47,133.73 arc45 32.11,133.58 v29.46,130.94
DIM6B  (via drill 0.35)
  Top 0.305: v10.67,108.2 10.67,108.18 10.23,107.74 U6.11 8.76,107.74 arc45 8.4,107.59 7.9,107.08 arc45 7.75,106.72 7.75,103.06 arc45 7.9,102.7 R38.1
  Bottom 0.305: v10.67,108.2 9.38,106.91 9.38,89.6 arc-45 9.23,89.24 SV1.1
DSCLM1  (1 unrouted)
  Top 0.305: R9.1 8.66,130.85 10.15,130.85 | 10.15,130.85 R8.2 | IC1.6 10.55,128.68 10.15,129.07 10.15,130.85 | 10.4,130.85 10.4,131.74 11.8,133.14 11.8,135.04 12.31,135.55 13.96,135.55 14.34,135.93 J4.DSCLM(5)
DSCLP1
  Top 0.305: R9.2 R7.1 9.17,128.19 9.64,128.19 9.78,128.18 IC1.7 13.12,128.18 13.46,128.52 13.46,131.99 13.45,132 J4.DSCLP(4)
DSDAM1  (via drill 0.35)
  Top 0.305: J4.DSDAM(2) 18.15,133.77 14.72,130.09 14.72,129.84 | R5.2 R4.1 arc-90 14.21,124.54 v14.21,125.52 14.21,125.65 | v15.48,129.84 14.72,129.84 | IC1.9 13.89,127.18 14.72,128.01 14.72,129.84
  Bottom 0.305: v15.48,129.84 14.21,128.57 v14.21,125.52
DSDAP1  (via drill 0.35)
  Top 0.305: R6.2 R5.1 11.33,125.69 v11.42,125.77 | 14.98,131.62 14.09,130.73 14.09,128.26 13.51,127.68 IC1.8 | 14.98,131.62 16.88,133.52 16.88,134.79 17.64,135.55 18.28,135.55 J4.DSDAP(1) | v14.47,131.87 14.72,131.87 14.98,131.62
  Bottom 0.305: v11.42,125.77 13.45,127.81 13.45,130.85 v14.47,131.87
GND  (via drill 0.35)
  Top 0.305: IC1.5 16.33,128.76 15.72,128.76 15.24,128.28 15.24,126.36 15.83,125.77 16.13,125.77 | R20.1 39.5,137.12 C10.2 | U4.14 27.98,135.68 | 27.98,135.68 27.81,135.51 | 27.98,135.68 27.47,135.68 TP25.1 | R4.2 16.13,124.42 16.13,125.77 | 16.13,125.77 v16.75,125.77 | v140.97,25.4 144.78,25.4 146.05,24.13 146.05,11.43 144.44,9.82 137.6,9.82 137.5,9.72 137.5,2.88 135.89,1.27 102.92,1.27 102.9,1.24 | C4.2 132.59,115.57 132.08,115.57
  Top 0.508: D2.2 139.53,115.39
  Top 1.016: v123.19,108.51 121.28,108.51 119.46,106.68 119.38,106.68 118.87,106.17 118.87,88.65 121.41,86.11
  Top 1.524: 113.63,119.98 112.39,121.21
  Top 2.032: v120.65,112.95 120.65,113.67 114.34,119.98 113.63,119.98
  Bottom 0.508: v133.35,134.62 133.35,129.54 132.33,128.52 131.36,128.52 128.4,125.56 128.4,120.65 | 123.4,4.87 119.85,1.32 119.84,1.32 | 119.84,1.32 119.33,1.32 118.17,2.48 117.67,2.48 116.65,1.46 115.89,1.46 115.19,2.16 | 119.84,1.32 119.89,1.27 128.27,1.27 132.08,5.08 | JP2.4 12.7,21.59
  Bottom 0.61: 125.59,7.06 123.4,4.87 | 138.3,26.67 137.16,26.67 | 113.03,3.81 113.12,3.81 arc-45 113.84,3.51 115.19,2.16 | 142.49,24.13 142.49,18.78 arc-45 142.2,18.06 140.88,16.74 arc-45 140.16,16.45 137.66,16.45 137.61,16.44 137.27,16.45 134.62,16.45
  other vias: 115.82,143.51 115.82,142.24 115.82,140.97 115.82,137.16 115.82,138.43 115.82,139.7 114.55,139.7 113.28,143.51 113.28,142.24 114.55,140.97 114.55,142.24 114.55,143.51 136.14,135.89 136.14,134.62 134.87,134.62 136.14,142.24 136.14,139.7 136.14,137.16 136.14,138.43 136.14,140.97 136.14,143.51 134.87,135.89 137.41,134.62 137.41,135.89 132.08,111.56 135.38,100.33 131.32,91.19 125.48,96.27 124.71,96.27 124.71,95.5 125.48,95.5 123.95,96.27 123.95,95.5 135.38,102.62 138.43,82.3 137.67,82.3 138.43,83.06 137.67,83.06 139.19,82.3 139.19,83.06 137.67,77.47 137.67,76.71 138.43,77.47 139.19,77.47 138.43,76.71 139.19,76.71 133.86,80.26 135.13,74.17 133.86,79.25 134.87,86.61 130.56,80.77 121.92,90.17 127,85.09 134.62,88.9 140.97,86.36 120.65,106.68 121.92,96.52 131.06,106.55 138.43,106.68 134.62,71.12 130.81,71.12 139.7,38.1 139.7,27.94 143.51,31.75 128.27,36.83 11.93,129.58 12.44,132.12 26.67,143.51 34.04,141.6 3.81,129.54 5.08,139.7 9.53,135.89 142.49,46.99 143,65.66 134.62,52.07 128.27,54.61 127,29.21 121.67,27.3 10.16,115.57 22.86,130.81 21.59,134.62 103.25,1.78 103.12,9.78 111.63,4.7 113.67,10.41 114.94,18.67 115.06,128.14 97.79,10.16 60.96,3.81 85.09,8.89 17.65,11.18 10.16,15.24 13.34,7.62 41.91,139.7 41.91,134.75 41.91,129.54 29.21,132.72 27.43,137.41 97.03,138.43 51.31,138.43 62.74,138.43 74.17,138.43 85.6,138.43 108.58,138.3 106.43,141.6 95,141.6 83.57,141.6 72.14,141.6 60.83,141.6 49.4,141.6 46.35,136.91 57.78,136.91 69.22,136.91 80.64,136.91 92.08,136.91 103.5,136.91 43.18,127 45.72,127 48.26,127 55.88,127 58.42,127 60.96,127 67.31,127 69.85,127 72.39,127 78.74,127 81.28,127 83.82,127 90.17,127 92.71,127 95.25,127 101.6,127 104.14,127 106.68,127 43.18,140.97 44.45,134.75 54.61,140.97 55.88,132.08 66.04,140.97 67.31,132.08 77.47,140.97 78.74,133.35 88.9,140.97 90.17,133.35 100.33,140.97 101.6,134.62 98.3,145.67 73.66,145.67 52.83,145.67 115.06,123.44 26.54,127.13 143.51,90.17 133.35,135.89 136.14,144.78 6.35,119.38 8,122.17 2.54,97.79 10.67,91.19 5.08,82.55 10.41,82.8 11.18,66.42 6.35,57.15 6.48,97.16 7.62,44.45 8.89,41.91 8.89,34.29 8.89,22.86 8.89,49.53 3.81,124.46 4.7,99.82 7.62,91.44 7.62,86.36 7.49,110.62 138.68,134.62
  pour Bottom (isolate 0.305): 134.99,16.77 134.99,4.58 122.29,4.58 122.29,16.77
  pour Top (isolate 0.305, rank 2): 119.38,117.35 141.22,117.35 141.22,89.41 119.38,89.41
  pour Bottom (isolate 0.406, rank 2): 119.63,89.41 146.05,89.41 146.05,120.4 119.63,120.4
  pour Top (isolate 0.406, rank 3): 141.48,90.17 127.89,90.17 127.89,72.39 141.48,72.39
  pour Bottom (isolate 0.406): 146.05,89.28 146.05,24.13 125.22,24.13 125.22,89.28
  pour Top: 112.65,19.3 112.65,11.43 12.7,11.43 12.7,146.05 1.27,146.05 1.27,1.27 119.38,1.27 119.38,19.3
  pour Top: 119.38,24.13 146.05,24.13 146.05,88.52 139.45,88.52 139.45,72.39 133.35,72.39 133.35,71.75 128.02,71.75 128.02,86.49 125.22,86.49 125.22,26.92 119.38,26.92
  pour Top: 12.7,146.05 146.05,146.05 146.05,86.36 142.88,86.36 142.88,105.41 140.97,105.41 140.97,128.78 129.29,128.78 129.29,136.65 116.33,136.65 116.33,119.38 111.76,119.38 111.76,126.62 12.7,126.62
  pour Top: 121.16,85.98 125.6,81.53 125.6,81.41 125.73,81.28 127,81.28 127,85.09 125.73,86.36 121.92,86.36 121.54,86.36
  pour Top: 119.38,26.67 137.16,44.45 137.16,26.67
  pour Bottom: 115.57,18.03 111.38,18.03 111.38,11.43 12.7,11.43 12.7,123.19 1.27,123.19 1.27,1.27 115.57,1.27
  pour Bottom: 119.38,26.67 125.73,33.02 134.62,33.02 134.62,26.67
  pour Bottom: 1.27,120.65 1.27,146.05 137.16,146.05 137.16,137.16 146.05,137.16 146.05,119.38 140.97,119.38 140.97,127.51 129.29,127.51 129.29,136.65 116.33,136.65 116.33,126.62 25.02,126.62 10.16,111.76
  pour Bottom: 119.38,90.17 125.73,83.82 128.27,83.82 128.27,90.17
  pour Bottom: 113.28,137.67 113.28,122.05 114.68,120.65 118.11,120.65 123.83,114.94 146.05,114.94 146.18,114.81 146.18,121.16 116.84,121.16 116.33,121.67 116.33,137.79 113.41,137.79
  pour Bottom: 134.62,115.57 142.62,107.57 142.62,89.28 139.7,86.36 139.7,83.82 146.05,83.82 146.05,115.57 144.78,116.84 135.89,116.84
  pour Bottom: 120.65,27.94 111.38,18.67 111.38,16.51 115.57,16.51 123.19,24.13 127,24.13 127,27.94
  pour Top: 114.3,17.78 120.65,24.13 120.65,25.4 118.11,25.4 114.3,21.59
LED1+  (via drill 0.35)
  Top 0.305: U$48.4 50.84,142.96 RS11.1
  Top 0.508: C43.2 51.01,139.91 U$48.4
  Top 0.61: C43.2 53.42,139.32 53.56,139.32 53.89,139 53.89,128.45 52.44,127 v52.07,127
  Bottom 0.305: U$2.A2 U$2.A1 35.05,116.55 arc45 35.41,116.69 44.05,125.33 arc-45 44.41,125.48 50.34,125.48 arc45 50.7,125.62 v52.07,127
LED1-  (via drill 0.35)
  Top 0.305: 52.83,134.62 52.83,133.08 L12.2 51.83,130.57 50.8,129.54 50.8,127 49.53,125.73 25.93,125.73 arc45 25.03,125.36 15.08,115.41 arc45 14.71,114.51 14.71,79.04 14.94,78.81 14.94,60.32 arc-45 14.56,59.42 14.32,59.17 arc45 13.95,58.27 13.95,33.2 arc45 14.32,32.31 23.26,23.36 arc45 24.16,22.99 101.2,22.99 arc45 102.1,23.36 v111.76,33.02
  Top 0.508: C43.1 52.83,134.62
  Bottom 0.305: U$7.C2 U$7.C1 113.7,33.02 v111.76,33.02
LED2+  (via drill 0.35)
  Top 0.305: U$46.4 62.27,142.96 RS9.1
  Top 0.508: U$46.4 62.43,139.91 C37.2
  Top 0.61: C37.2 64.85,139.32 64.99,139.32 65.32,139 65.32,128.45 63.87,127 v63.5,127
  Bottom 0.305: U$8.A2 U$8.A1 52.84,116.55 arc45 53.19,116.69 v63.5,127
LED2-  (via drill 0.35)
  Top 0.305: 64.26,134.62 64.26,133.08 L10.2 62.23,131.05 62.23,127 60.96,125.73 50.32,125.73 49.76,125.17 26.16,125.17 arc45 25.26,124.8 15.64,115.18 arc45 15.27,114.28 15.27,81.28 15.27,79.27 15.49,79.04 15.49,59.96 arc-45 15.12,59.06 14.86,58.8 arc45 14.5,57.94 14.5,33.44 arc45 14.88,32.54 23.39,24.02 arc45 24.29,23.65 85.35,23.65 arc45 86.25,24.02 v95.25,33.02
  Top 0.508: C37.1 64.26,134.62
  Bottom 0.305: U$13.C2 U$13.C1 97.2,32.73 96.9,33.02 v95.25,33.02
LED3+  (via drill 0.35)
  Top 0.305: 73.86,139.91 U$44.4 73.66,140.12 73.66,143 RS7.1
  Top 0.508: C31.2 73.86,139.91
  Top 0.61: C31.2 76.28,139.32 76.42,139.32 76.75,139 76.75,128.45 75.3,127 v74.93,127
  Bottom 0.305: U$14.A2 U$14.A1 68.08,116.55 arc45 68.43,116.69 74.78,123.04 arc45 74.93,123.4 v74.93,127
LED3-  (via drill 0.35)
  Top 0.305: v78.61,33.02 78.59,33.02 70.15,24.58 arc-45 69.25,24.21 24.52,24.21 arc-45 23.62,24.58 15.43,32.77 arc-45 15.06,33.67 15.06,57.64 arc-45 15.34,58.32 15.8,58.78 arc45 16.18,59.68 16.18,79.15 15.82,79.5 15.82,114.05 arc-45 16.2,114.95 25.55,124.31 arc-45 26.3,124.61 49.99,124.61 50.55,125.17 61.19,125.17 61.74,125.72 72.38,125.72 73.66,127 73.66,131.05 L8.2 75.69,133.08 75.69,134.62
  Top 0.508: C31.1 75.69,134.62
  Bottom 0.305: U$19.C2 U$19.C1 80.17,33.02 v78.61,33.02
LED4+  (via drill 0.35)
  Top 0.305: 85.29,139.91 U$42.4 85.13,142.96 RS5.1
  Top 0.508: C25.2 85.29,139.91
  Top 0.61: C25.2 87.71,139.32 87.85,139.32 88.18,139 88.18,128.45 87.63,127.9 v87.63,127
  Bottom 0.305: U$20.A2 U$20.A1 84.84,116.55 arc45 85.2,116.69 87.48,118.98 arc45 87.63,119.34 v87.63,127
LED4-  (via drill 0.35)
  Top 0.305: 87.12,134.62 87.12,133.08 L6.2 85.09,131.05 85.09,127 83.82,125.73 73.28,125.73 72.71,125.16 62.04,125.16 61.47,124.59 50.8,124.59 50.27,124.05 26.62,124.05 arc45 25.72,123.68 16.75,114.71 arc45 16.38,113.82 16.38,79.83 16.74,79.47 16.74,59.28 arc-45 16.42,58.51 15.99,58.09 arc45 15.62,57.19 15.62,33.9 arc45 15.99,33 23.86,25.14 arc45 24.75,24.77 53.2,24.77 arc45 54.09,25.14 v61.98,33.02
  Top 0.508: C25.1 87.12,134.62
  Bottom 0.305: U$25.C2 U$25.C1 63.41,33.02 v61.98,33.02
LED5+  (via drill 0.35)
  Top 0.305: 96.72,139.91 U$38.4 96.56,142.96 RS1.1
  Top 0.508: C16.2 96.72,139.91
  Top 0.61: C16.2 99.14,139.32 99.28,139.32 99.61,139 99.61,127.72 v100.33,127
  Bottom 0.305: U$26.A2 U$26.A1 102.75,116.55 arc45 103.11,116.69 103.99,117.58 arc45 104.14,117.94 104.14,122.98 arc45 103.99,123.34 v100.33,127
LED5-  (via drill 0.35)
  Top 0.305: 98.55,134.62 98.55,133.08 L3.2 96.52,131.05 96.52,127 95.27,125.75 84.64,125.75 84.06,125.17 73.61,125.17 73.03,124.59 62.38,124.59 61.82,124.03 51.08,124.03 50.55,123.5 26.85,123.5 arc45 25.95,123.12 17.34,114.51 arc45 16.97,113.61 16.97,80.03 17.35,79.65 17.35,59.05 arc-45 16.98,58.15 16.58,57.75 arc45 16.2,56.85 16.2,34.1 arc45 16.58,33.21 24.01,25.77 arc45 24.91,25.4 36.81,25.4 arc45 37.71,25.77 v44.96,33.02
  Top 0.508: C16.1 98.55,134.62
  Bottom 0.305: U$31.C2 U$31.C1 46.64,33.02 v44.96,33.02
LED6+  (via drill 0.35)
  Top 0.305: 108.15,139.91 U$40.4 107.99,142.96 RS3.1
  Top 0.508: C19.2 108.15,139.91
  Top 0.61: C19.2 110.57,139.32 110.71,139.32 111.04,139 111.04,127.08 v111.12,127
  Bottom 0.305: U$32.A2 U$32.A1 117.14,117.42 116.08,118.49 115.32,118.49 111.12,122.68 v111.12,127
LED6-  (via drill 0.35)
  Top 0.305: 109.98,134.62 109.98,133.08 L4.2 107.95,131.05 107.95,127 106.68,125.73 96.14,125.73 95.6,125.19 84.87,125.19 84.26,124.59 73.94,124.59 73.38,124.03 62.61,124.03 62.05,123.47 51.31,123.47 50.78,122.94 27.2,122.94 arc45 26.3,122.56 17.9,114.16 arc45 17.53,113.27 17.53,80.26 17.91,79.88 17.91,58.82 arc-45 17.54,57.92 17.14,57.52 arc45 16.76,56.62 16.76,44.85 arc45 17.14,43.95 v28.32,32.77
  Top 0.508: C19.1 109.98,134.62
  Bottom 0.305: U$37.C2 U$37.C1 28.36,32.73 v28.32,32.77
LX1
  Top 0.305: 47.84,134.62 47.84,134.2 46.99,133.35 46.99,132.32 L12.1 47.23,134.38 46.99,134.62
  Top 0.508: D15.+ 44.8,136.81 46.99,134.62 | U$48.1 47.84,134.62
LX2
  Top 0.305: 59.27,134.62 59.27,132.69 L10.1 58.66,134.38 58.42,134.62 58.2,134.62
  Top 0.508: D13.+ 58.2,134.62 | U$46.1 59.27,134.62
LX3
  Top 0.305: 70.7,134.62 70.7,132.69 L8.1 70.09,134.38 69.85,134.62
  Top 0.508: D11.+ 67.66,136.81 69.85,134.62 | U$44.1 70.7,134.62
LX4
  Top 0.305: 82.13,134.62 82.13,132.69 L6.1 81.52,134.38 81.28,134.62
  Top 0.508: D9.+ 79.09,136.81 81.28,134.62 | U$42.1 82.13,134.62
LX5
  Top 0.305: 93.56,134.62 93.56,133.55 | 93.56,133.55 93.56,132.69 L3.1 | 92.6,134.51 93.56,133.55
  Top 0.508: D5.+ 92.6,134.51 | U$38.1 93.56,134.62
LX6
  Top 0.305: L4.1 104.99,132.69 104.99,134.62 104.14,134.62
  Top 0.508: D7.+ 103.92,134.62 104.14,134.62 | U$40.1 104.99,134.62
N$1
  Top 0.305: R1.1 121.15,118.35 D1.A
N$2
  Bottom 0.305: U$2.C1 U$2.C2 29.88,114.3 27.39,114.3 arc45 27.03,114.15 26.18,113.31 arc45 26.04,112.95 26.04,108.67 arc45 26.18,108.31 27.16,107.34 arc45 27.52,107.19 71.55,107.19 arc-45 71.9,107.04 73.51,105.43 arc-45 73.66,105.07 73.66,101.3 arc-45 73.51,100.94 72.54,99.97 arc-45 72.18,99.82 66.85,99.82 U$3.A1 U$3.A2
N$3
  Top 0.559: R2.1 133.83,100.57 D4.A
N$4
  Top 0.305: D3.A 135.87,76.47 135.87,82.45 136.88,83.47 136.88,83.51 137.94,84.56 R3.1
N$5
  Bottom 0.305: U$8.C1 U$8.C2 42.12,114.59 arc45 41.76,114.45 40.79,113.47 arc45 40.64,113.11 40.64,109.3 arc45 40.79,108.94 41.76,107.97 arc45 42.12,107.82 72.01,107.82 72.39,107.44 75.82,107.44 76.2,107.82 90.3,107.82 91.44,106.68 91.44,101.26 arc-45 91.29,100.9 90.32,99.93 arc-45 89.96,99.78 U$9.A1 U$9.A2
N$6
  Bottom 0.305: U$3.C1 U$3.C2 63.7,97.79 58.5,97.79 arc45 58.14,97.64 57.17,96.67 arc45 57.02,96.31 57.02,91.65 arc45 57.17,91.29 58.14,90.32 arc45 58.5,90.17 105.2,90.17 arc-45 105.56,90.02 106.53,89.05 arc-45 106.68,88.69 106.68,84.28 arc-45 106.53,83.92 105.77,83.17 arc-45 105.41,83.02 U$4.A1 U$4.A2
N$7
  Bottom 0.305: U$9.C1 U$9.C2 80.47,97.79 75.14,97.79 arc45 74.78,97.64 73.81,96.67 arc45 73.66,96.31 73.66,91.44 74.3,90.81 115.49,90.81 arc-45 115.85,90.66 119.23,87.27 arc-45 119.38,86.91 119.38,84.03 arc-45 119.23,83.67 118.73,83.17 arc-45 118.37,83.02 U$10.A1 U$10.A2
N$8  (via drill 0.35)
  Top 0.305: v88.9,76.2 v88.9,72.26
  Bottom 0.305: U$4.C1 U$4.C2 90.38,81.07 arc45 90.02,80.92 89.05,79.95 arc45 88.9,79.59 v88.9,76.2 | U$5.A2 U$5.A1 56.65,66.25 arc45 57,66.4 57.76,67.16 arc45 57.91,67.52 57.91,71.42 arc-45 58.06,71.78 58.65,72.37 arc-45 59.01,72.52 88.44,72.52 arc-45 88.8,72.37 v88.9,72.26
N$9  (via drill 0.35)
  Top 0.305: v107.95,76.2 v107.95,74.04
  Bottom 0.305: U$11.A2 U$11.A1 39.37,66.25 arc45 39.73,66.4 40.49,67.16 arc45 40.64,67.52 40.64,73.03 arc-45 40.79,73.39 41.52,74.12 arc-45 41.87,74.27 107.51,74.27 arc-45 107.87,74.12 v107.95,74.04 | U$10.C1 114,81.58 114.3,81.28 114.09,81.07 U$10.C2 109.43,81.07 arc45 109.07,80.92 108.1,79.95 arc45 107.95,79.59 v107.95,76.2
N$10
  Bottom 0.305: U$5.C1 U$5.C2 42.12,64.3 arc45 41.76,64.15 40.79,63.18 arc45 40.64,62.82 40.64,57.99 arc45 40.79,57.64 41.76,56.66 arc45 42.12,56.52 87.42,56.52 arc-45 87.78,56.37 88.75,55.39 arc-45 88.9,55.03 88.9,52.07 88.9,50.97 arc-45 88.75,50.61 87.78,49.64 arc-45 87.42,49.49 U$6.A1 U$6.A2
N$11
  Bottom 0.305: U$6.C1 U$6.C2 76.41,47.54 arc45 76.05,47.39 75.08,46.42 arc45 74.93,46.06 74.93,42.76 arc45 75.08,42.4 76.05,41.42 arc45 76.41,41.27 117.9,41.27 arc-45 118.26,41.13 119.23,40.15 arc-45 119.38,39.8 119.38,34.2 arc-45 119.23,33.85 118.11,32.73 U$7.A1 U$7.A2
N$12
  Bottom 0.305: U$11.C1 U$11.C2 28.15,64.3 arc45 27.79,64.15 26.82,63.18 arc45 26.67,62.82 26.67,57.36 arc45 26.82,57 27.79,56.03 arc45 28.15,55.88 72.18,55.88 arc-45 72.54,55.73 73.51,54.76 arc-45 73.66,54.4 73.66,51.01 arc-45 73.51,50.65 72.5,49.64 arc-45 72.14,49.49 U$12.A1 U$12.A2
N$13
  Bottom 0.305: U$12.C1 U$12.C2 58.63,47.54 arc45 58.27,47.39 57.3,46.42 arc45 57.15,46.06 57.15,42.12 arc45 57.3,41.76 58.27,40.79 arc45 58.63,40.64 105.2,40.64 arc-45 105.56,40.49 106.53,39.52 arc-45 106.68,39.16 106.68,34.2 arc-45 106.53,33.85 105.56,32.87 arc-45 105.2,32.73 U$13.A1 U$13.A2
N$14
  Bottom 0.305: U$14.C1 U$14.C2 63.7,114.3 58.5,114.3 arc45 58.14,114.15 57.17,113.18 arc45 57.02,112.82 57.02,110.06 arc45 57.17,109.71 58.27,108.61 arc45 58.63,108.46 72.29,108.46 72.75,108 75.59,108 76.05,108.46 115.74,108.46 arc-45 116.1,108.31 117.07,107.34 arc-45 117.22,106.98 117.22,99.85 U$15.A1 U$15.A2
N$15  (via drill 0.35)
  Top 0.305: v57.02,87.63 58.3,88.91 arc-45 59.2,89.28 103.36,89.28 arc45 104.26,89.65 v106.68,92.08
  Bottom 0.305: U$16.A2 U$16.A1 55.68,83.02 56.9,84.23 56.9,87.5 v57.02,87.63 | U$15.C1 U$15.C2 114,97.79 108.16,97.79 arc45 107.8,97.64 106.83,96.67 arc45 106.68,96.31 v106.68,92.08
N$16  (via drill 0.35)
  Top 0.305: v41.91,76.2 v41.91,73.41
  Bottom 0.305: U$16.C1 U$16.C2 43.39,81.07 arc45 43.03,80.92 42.06,79.95 arc45 41.91,79.59 v41.91,76.2 | U$17.A2 U$17.A1 105.41,66.25 arc45 105.77,66.4 106.53,67.16 arc45 106.68,67.52 106.68,72.23 arc45 106.53,72.59 105.56,73.56 arc45 105.2,73.71 42.42,73.71 arc45 42.07,73.56 v41.91,73.41
N$17  (via drill 0.35)
  Top 0.305: v40.64,54.61 43.24,57.21 arc-45 44.14,57.58 88.04,57.58 arc45 88.94,57.95 v90.17,59.18
  Bottom 0.305: U$17.C1 U$17.C2 91.18,64.3 arc45 90.82,64.15 90.32,63.65 arc45 90.17,63.29 v90.17,59.18 | U$18.A2 U$18.A1 39.16,49.49 arc45 39.52,49.64 40.49,50.61 arc45 40.64,50.97 v40.64,54.61
N$18
  Bottom 0.305: U$18.C1 U$18.C2 28.15,47.54 arc45 27.79,47.39 26.82,46.42 arc45 26.67,46.06 26.67,24.34 arc45 26.82,23.98 27.79,23.01 arc45 28.15,22.86 88.69,22.86 arc45 89.05,23.01 90.02,23.98 arc45 90.17,24.34 90.17,29.3 arc45 90.02,29.65 89.05,30.63 arc45 88.69,30.77 U$19.A2 U$19.A1
N$19  (via drill 0.35)
  Top 0.305: v73.66,109.35 73.77,109.35 arc-45 74.67,108.97 75.07,108.58 arc45 75.96,108.2 105.14,108.2 arc-45 106.04,107.83 v106.68,107.19
  Bottom 0.305: U$20.C1 U$20.C2 75.14,114.59 arc45 74.78,114.45 73.81,113.47 arc45 73.66,113.11 v73.66,109.35 | U$21.A2 U$21.A1 105.2,99.78 arc45 105.56,99.93 106.53,100.9 arc45 106.68,101.26 v106.68,107.19
N$20  (via drill 0.35)
  Top 0.305: v41.15,87.63 43.75,90.23 arc-45 44.65,90.6 89.31,90.6 arc45 90.21,90.97 v91.31,92.08
  Bottom 0.305: U$22.A2 U$22.A1 39.41,83.02 arc45 39.77,83.17 40.87,84.27 arc45 41.02,84.62 41.02,87.5 v41.15,87.63 | U$21.C1 U$21.C2 97.23,97.79 92.92,97.79 arc45 92.56,97.64 91.46,96.54 arc45 91.31,96.18 v91.31,92.08
N$21
  Bottom 0.305: U$22.C1 U$22.C2 28.15,81.07 arc45 27.79,80.92 26.82,79.95 arc45 26.67,79.59 26.67,76.41 arc45 26.82,76.05 27.79,75.08 arc45 28.15,74.93 118.28,74.93 arc-45 118.64,74.78 119.87,73.56 arc-45 120.02,73.2 120.02,67.61 arc-45 119.87,67.25 119.02,66.4 arc-45 118.66,66.25 U$23.A1 U$23.A2
N$22  (via drill 0.35)
  Top 0.305: v55.88,54.61 55.88,54.74 57.03,55.89 arc-45 57.93,56.26 103.23,56.26 arc45 104.13,56.63 v106.68,59.18
  Bottom 0.305: U$24.A2 U$24.A1 54.4,49.49 arc45 54.76,49.64 55.73,50.61 arc45 55.88,50.97 v55.88,54.61 | U$23.C1 U$23.C2 107.69,64.3 arc45 107.33,64.15 106.83,63.65 arc45 106.68,63.29 v106.68,59.18
N$23
  Bottom 0.305: U$24.C1 U$24.C2 42.12,47.54 arc45 41.76,47.39 40.79,46.42 arc45 40.64,46.06 40.64,40.85 arc45 40.79,40.49 41.13,40.15 arc45 41.48,40.01 70.91,40.01 arc-45 71.27,39.86 72.24,38.88 arc-45 72.39,38.52 72.39,34.2 arc-45 72.24,33.85 71.27,32.87 arc-45 70.91,32.73 U$25.A1 U$25.A2
N$24  (via drill 0.35)
  Top 0.305: v40.64,105.92 41.02,106.3 66.78,106.3 arc45 67.68,106.67 71.51,110.5 arc-45 72.41,110.87 74.02,110.87 arc-45 74.92,110.5 75.7,109.72 arc45 76.6,109.35 90.41,109.35 arc45 91.3,109.72 v91.31,109.73
  Bottom 0.305: U$27.A2 U$27.A1 38.99,99.78 arc45 39.35,99.93 40.49,101.07 arc45 40.64,101.43 v40.64,105.92 | U$26.C1 97.23,114.86 97.5,114.59 | 97.79,114.3 97.5,114.59 | 97.5,114.59 U$26.C2 92.92,114.59 arc45 92.56,114.45 91.46,113.35 arc45 91.31,112.99 v91.31,109.73
N$25
  Bottom 0.305: U$27.C1 U$27.C2 30.18,97.79 28.15,97.79 arc45 27.79,97.64 26.82,96.67 arc45 26.67,96.31 26.67,90.38 arc45 26.82,90.02 27.79,89.05 arc45 28.15,88.9 72.31,88.9 arc-45 72.67,88.75 73.64,87.78 arc-45 73.79,87.42 73.79,84.62 arc-45 73.64,84.27 72.54,83.17 arc-45 72.18,83.02 U$28.A1 U$28.A2
N$26  (via drill 0.35)  (1 unrouted)
  Top 0.305: v57.28,76.2 v57.28,72.9
  Bottom 0.305: U$28.C1 63.7,81.48 63.5,81.28 | U$29.A2 U$29.A1 88.78,66.25 arc45 89.14,66.4 89.89,67.16 arc45 90.04,67.52 90.04,72.05 arc45 89.89,72.41 89.3,73 arc45 88.94,73.15 57.53,73.15 v57.28,72.9 | v57.28,76.2 57.28,80.01 58.33,81.07 U$28.C2
N$27
  Bottom 0.305: U$29.C1 U$29.C2 75.14,64.3 arc45 74.78,64.15 73.81,63.18 arc45 73.66,62.82 73.66,58.42 74.29,57.79 117.9,57.79 arc-45 118.26,57.64 119.87,56.03 arc-45 120.02,55.67 120.02,50.33 arc-45 119.87,49.98 119.53,49.64 arc-45 119.17,49.49 U$30.A1 U$30.A2
N$28  (via drill 0.35)
  Top 0.305: v106.68,42.67 104.64,40.63 arc-45 103.74,40.26 59.2,40.26 arc45 58.3,39.89 v57.15,38.73
  Bottom 0.305: U$30.C1 U$30.C2 108.16,47.54 arc45 107.8,47.39 106.83,46.42 arc45 106.68,46.06 v106.68,42.67 | U$31.A2 U$31.A1 50.09,33.02 55.67,33.02 arc45 56.03,33.17 57,34.14 arc45 57.15,34.5 v57.15,38.73
N$29  (via drill 0.35)
  Top 0.305: v106.55,109.73 105.96,109.14 arc-45 105.06,108.76 76.29,108.76 arc-45 75.4,109.14 74.67,109.86 arc45 73.77,110.24 72.66,110.24 arc45 71.76,109.86 67.94,106.04 arc-45 67.04,105.66 57.93,105.66 arc45 57.03,105.29 v57.02,105.28
  Bottom 0.305: U$33.A2 U$33.A1 55.5,99.78 arc45 55.86,99.93 56.87,100.94 arc45 57.02,101.3 v57.02,105.28 | U$32.C1 U$32.C2 108.16,114.59 arc45 107.8,114.45 106.7,113.35 arc45 106.55,112.99 v106.55,109.73
N$30
  Bottom 0.305: U$33.C1 U$33.C2 46.94,97.79 43.39,97.79 arc45 43.03,97.64 42.06,96.67 arc45 41.91,96.31 41.91,91.02 arc45 42.06,90.66 43.03,89.68 arc45 43.39,89.53 89.96,89.53 arc-45 90.32,89.39 91.29,88.41 arc-45 91.44,88.06 91.44,84.67 arc-45 91.29,84.31 90.15,83.17 arc-45 89.79,83.02 U$34.A1 U$34.A2
N$31  (via drill 0.35)
  Top 0.305: v73.79,76.2 v73.79,71.25
  Bottom 0.305: U$34.C1 U$34.C2 75.05,81.07 arc45 74.69,80.92 73.94,80.16 arc45 73.79,79.8 v73.79,76.2 | U$35.A2 U$35.A1 72.18,66.25 arc45 72.54,66.4 73.64,67.5 arc45 73.79,67.86 v73.79,71.25
N$32
  Bottom 0.305: U$35.C1 U$35.C2 58.63,64.3 arc45 58.27,64.15 57.3,63.18 arc45 57.15,62.82 57.15,58.63 arc45 57.3,58.27 58.27,57.3 arc45 58.63,57.15 105.2,57.15 arc-45 105.56,57 106.53,56.03 arc-45 106.68,55.67 106.68,50.97 arc-45 106.53,50.61 105.56,49.64 arc-45 105.2,49.49 U$36.A1 U$36.A2
N$33  (via drill 0.35)
  Top 0.305: v90.17,42.67 89.45,41.95 arc-45 88.55,41.58 44.01,41.58 arc45 43.11,41.21 v40.64,38.73
  Bottom 0.305: U$36.C1 U$36.C2 91.65,47.54 arc45 91.29,47.39 90.32,46.42 arc45 90.17,46.06 v90.17,42.67 | U$37.A2 U$37.A1 38.87,32.73 arc45 39.22,32.87 40.49,34.14 arc45 40.64,34.5 v40.64,38.73
N$36
  Bottom 1.016: TP18.TP D8.C 6.73,69.22 Q2.D
SCL  (via drill 0.35)
  Top 0.305: IC1.4 18.99,128.18 R11.1 19.38,128.14 TP27.1 | U4.16 29.08,134.38 26.28,131.57 arc45 25.91,130.68 25.91,130.32 arc-45 25.54,129.42 24.35,128.23 arc-45 24.13,128.14 23.37,128.14 | 22.65,128.1 TP27.1 | TP27.1 22.86,128.14 | 22.86,128.14 23.37,128.14 | 22.86,128.14 23.3,127.7 | v127.25,3.56 125.9,2.2 arc-45 125.18,1.91 114.94,1.91 v94.11,3.81 92.71,3.81 90.23,4.08 72.5,8.09 65.91,9.6 63.49,9.97 60.96,10.16 15.26,10.16 arc-45 14.36,10.53 13.07,11.82 arc-45 12.7,12.72 v12.7,29.21 12.7,59.4 arc-45 13,60.12 13.67,60.79 arc45 13.97,61.51 13.97,76.92 arc45 13.67,77.64 13,78.31 arc-45 12.7,79.03 v12.7,111.25 | v12.7,111.25 12.7,114.28 arc-45 13.07,115.18 22.93,125.04 arc45 23.3,125.94 23.3,127.7 | 23.3,127.7 23.37,128.14 | U6.16 10.4,110.99 v10.67,111.25 | TP39.1 v12.7,111.25 | JP1.7 v10.16,29.21
  Bottom 0.305: U1.6 131.06,7.81 arc-45 130.76,7.09 128.87,5.21 | v127.25,3.56 arc-45 127.28,3.61 128.87,5.21 | TP2.TP arc45 128.87,5.21 | J1.SCL v94.11,3.81 | v10.67,111.25 v12.7,111.25 | v10.16,29.21 v12.7,29.21
SDA  (via drill 0.35)
  Top 0.305: IC1.2 18.87,127.18 R10.1 20.5,126.87 | v21.72,126.87 TP26.1 20.5,126.87 | v124.46,3.56 123.74,2.84 arc-45 123.02,2.54 118.11,2.54 96.65,5.21 | 96.65,5.21 J1.SDA | 96.65,5.21 91.44,5.21 88.72,5.55 v73.66,8.89 | v64.77,8.89 15,8.89 arc-45 14.11,9.26 12.18,11.19 arc-45 11.81,12.08 11.81,22.86 11.68,26.8 11.68,31.75 | 11.81,110.36 11.81,115.16 arc-45 12.18,116.06 20.13,124.01 arc45 20.5,124.91 20.5,126.87 | v24.26,129.29 24.26,130.41 arc-45 24.63,131.31 27.98,134.66 arc-45 28.87,135.03 U4.15 | U6.15 11.79,110.34 11.81,110.36 | 11.81,110.36 TP38.1 11.89,105.21 11.89,99.06 11.81,95.25 11.81,78.78 arc45 12.11,78.06 13.11,77.06 arc-45 13.28,76.64 13.28,61.91 arc-45 13.11,61.5 12.11,60.5 arc45 11.81,59.78 11.81,36.83 11.68,32.89 11.68,31.75 | JP1.8 11.68,31.75
  Bottom 0.305: v24.26,129.29 21.84,126.87 v21.72,126.87 | U1.1 128.26,7.81 arc-45 127.96,7.09 124.46,3.59 v124.46,3.56 arc-45 124.47,3.59 TP1.TP | v64.77,8.89 v73.66,8.89
T1  (via drill 0.35)